# EasyEDA Pro project project-rp2350-board-04-12.epro

# Schematic Schematic1
Board Name: Board1; Create Date: 2025-04-10; Page Name: P1; Project Name: rp2350-impa; Schematic Name: Schematic1; Update Date: 2025-04-12; Company: EasyEDA.com; Page Size: A4; Version: V1.0
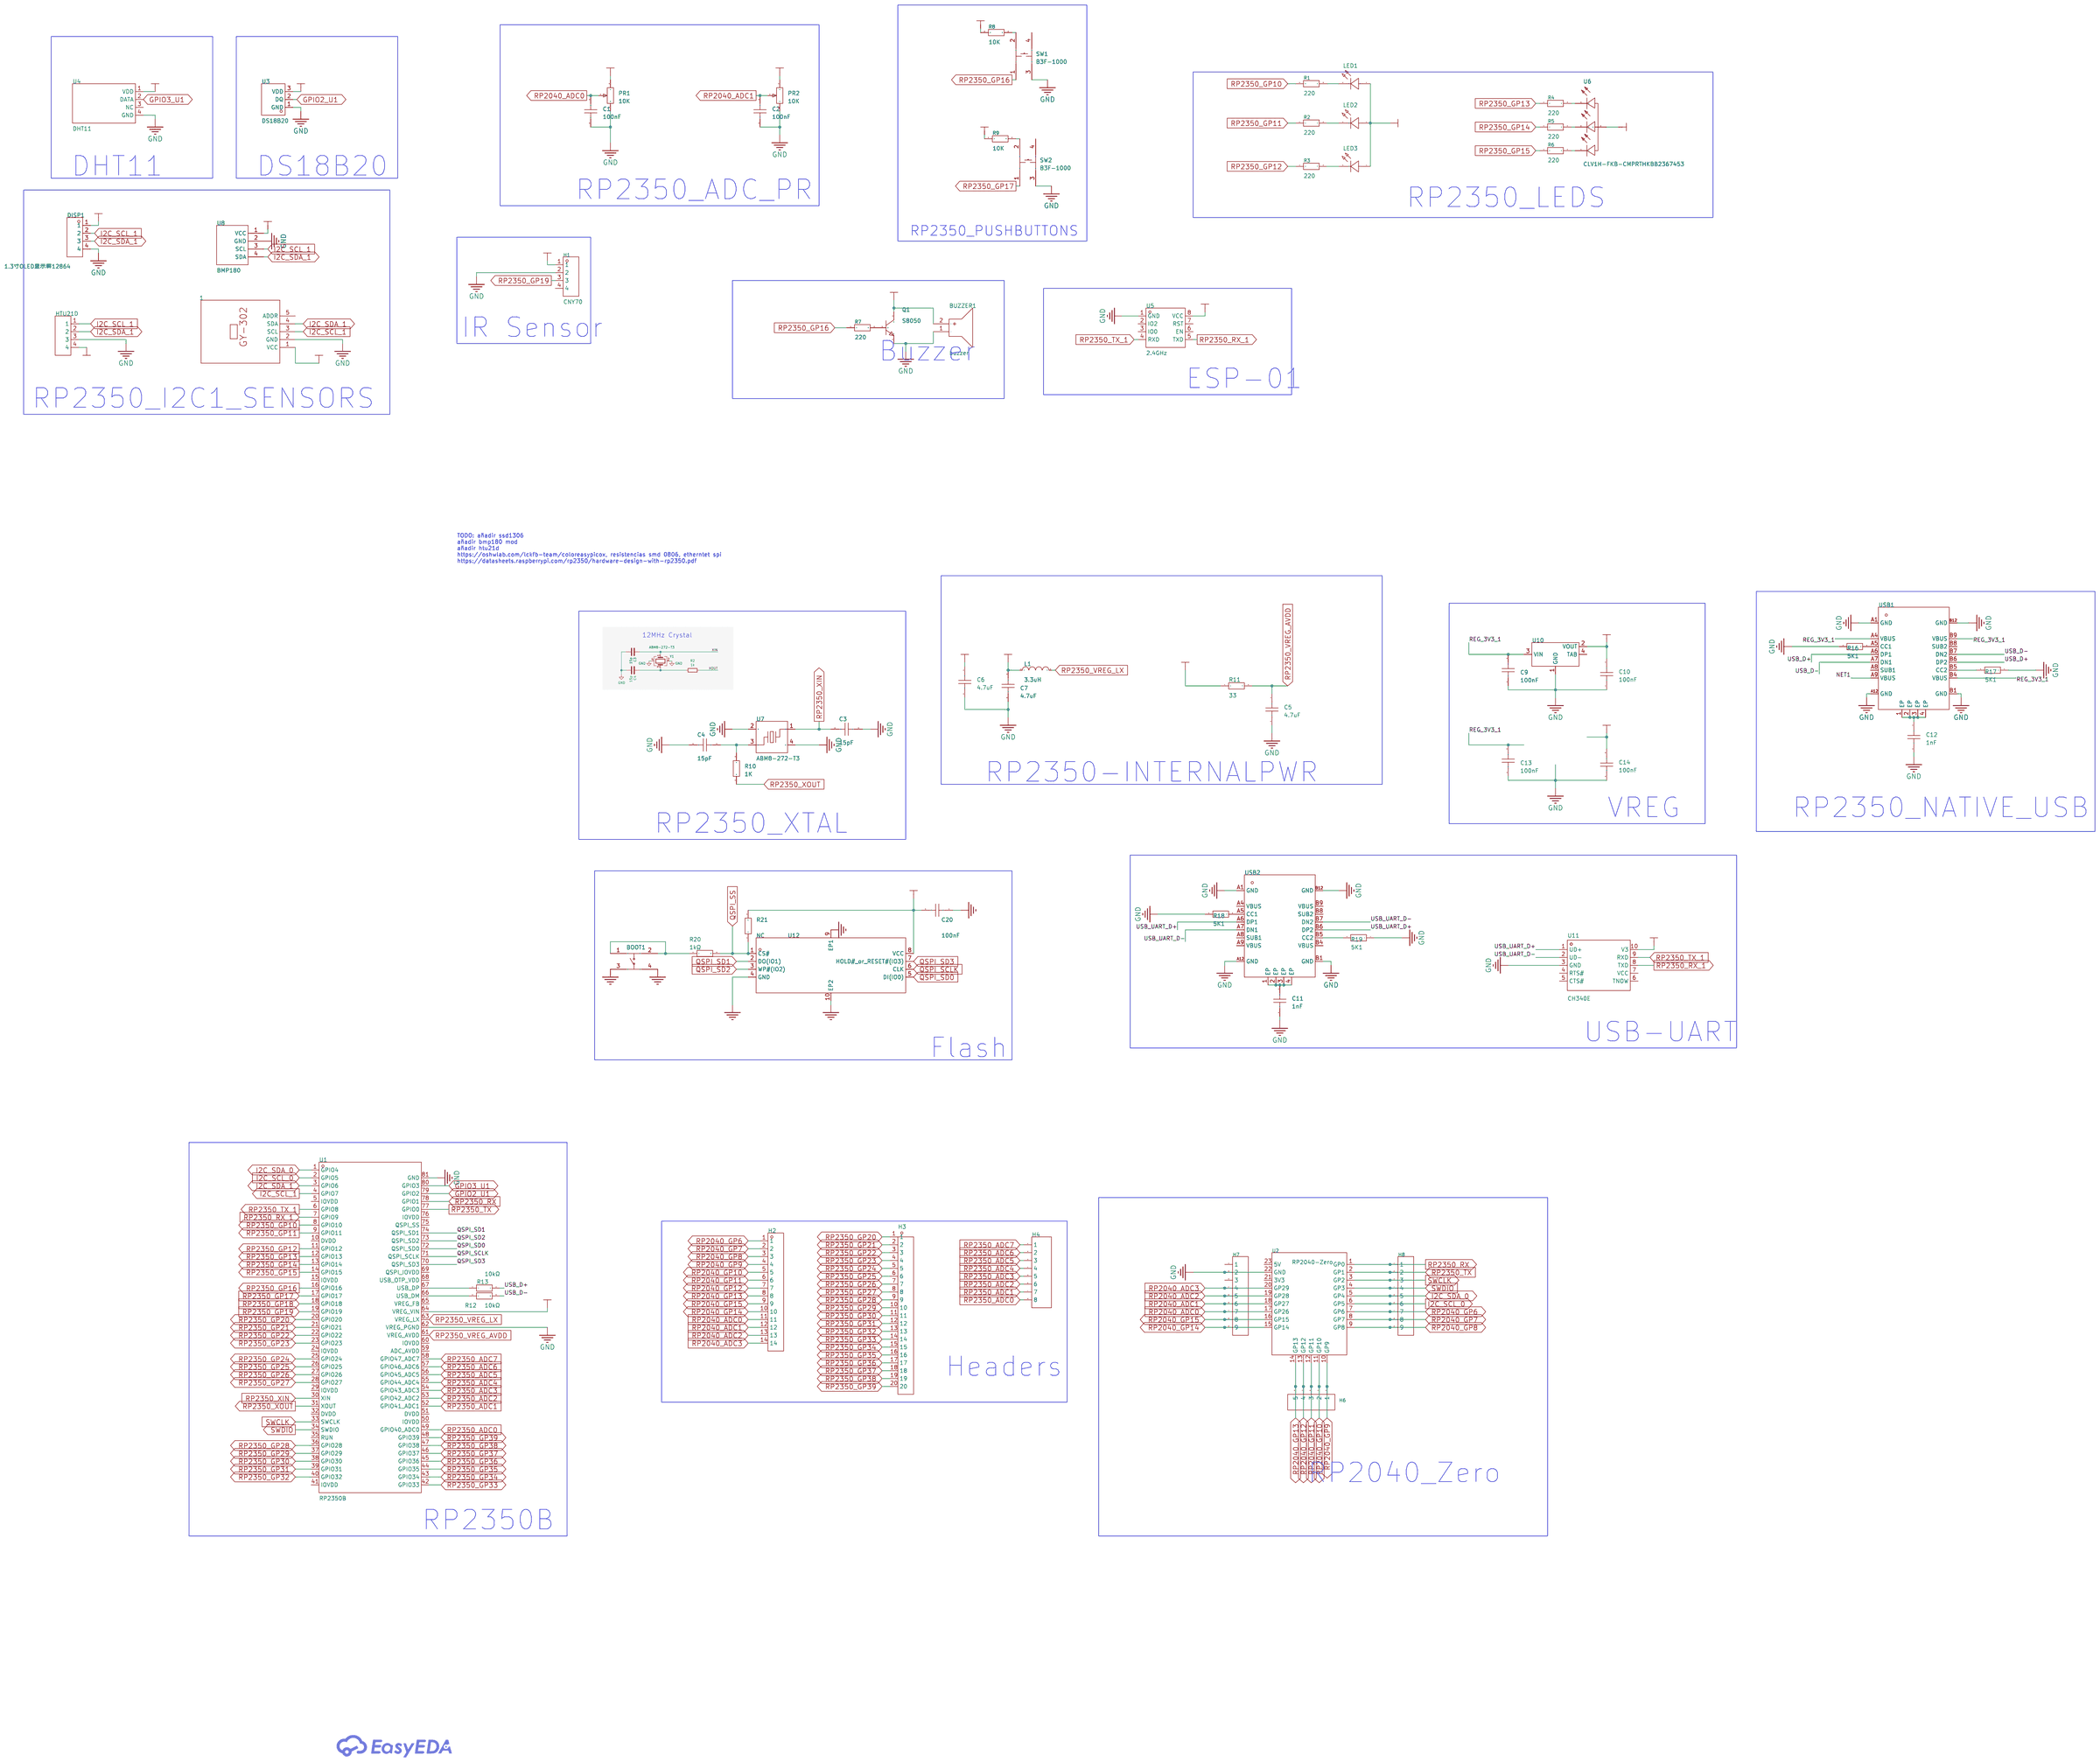
[diagram p0: schematic sheet]

## Parts
1  -  [GY-302 (BH1750)]
BOOT1  K2-1808SN-A4SW-01  [KEY-SMD_4P-L4.2-W3.2-P2.20-LS5.1-TL]
BUZZER1  buzzer  [BUZ-TH_BD12.0-P6.00-D0.9-RD]
C1  100nF  [C0201]
C2  100nF  [C0201]
C3  15pF  [C0201]
C4  15pF  [C0201]
C5  4.7uF  [C0201]
C6  4.7uF  [C0201]
C7  4.7uF  [C0201]
C9  100nF  [C0201]
C10  100nF  [C0201]
C11  1nF  [C0201]
C12  1nF  [C0201]
C13  100nF  [C0201]
C14  100nF  [C0201]
C20  100nF  [R0402]
DISP1  1.3寸OLED显示屏12864  [OLED-TH12864]
H1  CNY70  [HDR-TH_4P-P2.54-V-F]
H2  -  [HDR-TH_14P-P2.54-V-M]
H3  -  [HDR-TH_20P-P2.54-V-M-1]
H4  -  [HDR-TH_8P-P2.54-V-M]
H6  -  [HDR-TH_5P-P2.54-V-F]
H7  -  [HDR-TH_9P-P2.54-V-F-1]
H8  -  [HDR-TH_9P-P2.54-V-F-1]
HTU21D  -  [HDR-TH_4P-P2.54-V-M]
L1  3.3uH  [L0402]
LED1  YLED0805W  [LED0805-R-RD_WHITE]
LED2  YLED0805W  [LED0805-R-RD_WHITE]
LED3  YLED0805W  [LED0805-R-RD_WHITE]
PR1  10K  [RES-ADJ-TH_3P-L9.5-W9.5-P2.54-BR-BS]
PR2  10K  [RES-ADJ-TH_3P-L9.5-W9.5-P2.54-BR-BS]
Q1  S8050  [SOT-23-3_L2.9-W1.3-P1.90-LS2.4-BR]
R1  33kΩ  [R0805]
R2  33kΩ  [R0805]
R3  33kΩ  [R0805]
R4  33kΩ  [R0805]
R5  33kΩ  [R0805]
R6  33kΩ  [R0805]
R7  33kΩ  [R0805]
R8  33kΩ  [R0805]
R9  33kΩ  [R0805]
R10  1K  [R0603]
R11  33  [R0603]
R12  10kΩ  [R0603]
R13  10kΩ  [R0603]
R16  5K1  [R0603]
R17  5K1  [R0603]
R18  5K1  [R0603]
R19  5K1  [R0603]
R20  1kΩ  [R0402]
R21  NC  [R0402]  (no BOM)
SW1  B3F-1000  [KEY-TH_4P-L6.2-W6.2-P4.50-LS6.5]
SW2  B3F-1000  [KEY-TH_4P-L6.2-W6.2-P4.50-LS6.5]
U1  RP2350B  [QFN-80_L10.0-W10.0-P0.40-TL-EP3.4]
U2  RP2040-Zero  [COMM-SMD_RP2040-ZERO]
U3  DS18B20  [TO-92-3_L4.5-W3.5-P1.27-L]
U4  DHT11  [SENSOR-TH_DHT11]
U5  2.4GHz  [WIFIM-TH_8P-L24.7-W14.4-P2.54]
U6  CLV1H-FKB-CMPRTHKBB2367453  [LED-SMD_4P-L3.2-W2.8-LS3.5-TL-B]
U7  ABM8-272-T3  [CRYSTAL-SMD_4P-L3.2-W2.5-BL]
U8  BMP180  [BMP-180]
U10  -  [SOT-223-4_L6.5-W3.5-P2.30-LS7.0-BR]
U11  CH340E  [MSOP-10_L3.0-W3.0-P0.50-LS5.0-BL]
U12  W25Q32JVUUIQ  [USON-8_L4.0-W3.0-P0.80-BL_WINBOND_UU]
USB1  -  [USB-C-SMD_KH-TYPE-C-16P]
USB2  -  [USB-C-SMD_KH-TYPE-C-16P]

## Library data of the parts
1 = GY-302 Light Sensor Module (BH1750)
BOOT1 = K2-1808SN-A4SW-01: 触点电流:50mA;额定电压(DC):12V;绝缘电阻:100MΩ;电路结构:单刀单掷;安装方式:立贴;按钮形状:椭圆形按钮;带灯:-;作用力:250gf@±30gf;机械寿命:100000;工作温度:-25℃~+85℃;开关长度:4.2mm;开关宽度:3.25mm;开关高度:2.5mm;; Circuit: 单刀单掷; Supplier: LCSC; Datasheet: https://atta.szlcsc.com/upload/public/pdf/source/20180927/C283535_7E7907F3E7B6C1691E1DC87E363D082A.pdf; Manufacturer: 韩国韩荣; Switch Width: 3.25mm; Supplier Part: C92589; Switch Height: 2.5mm; Switch Length: 4.2mm; Actuator Style: 椭圆形按钮; LCSC Part Name: 4.2mm*3.25mm; Mounting Sytle: 立贴; Contact Current: 50mA; Mechanical Life: 100000; Operating Force: 250gf@±30gf; JLCPCB Part Class: Extended Part; Supplier Footprint: SMD; Voltage Rating (DC): 12V; Insulation Resistance: 100MΩ; Operating Temperature: -25℃~+85℃
BUZZER1 = buzzer: Supplier Part: C9900014030; JLCPCB Part Class: Extended Part; Supplier: LCSC
C1-C7 C9-C14 = CAP_0201: Supplier Footprint: 0201
C20 = UMK105B7104KVHF: 容值:100nF;精度:±10%;额定电压:50V;材质(温度系数):X7R;; Supplier: LCSC; Datasheet: https://atta.szlcsc.com/upload/public/pdf/source/20190415/C386112_8E88B4AA4AA3A856ADC8B10D69A4BB16.pdf; Tolerance: ±10%; Manufacturer: TAIYO YUDEN(太诱); Supplier Part: C386112; Voltage Rated: 50V; LCSC Part Name: 100nF ±10% 50V UMK105B7104KVHF; JLCPCB Part Class: Extended Part; Supplier Footprint: 0402; Temperature Coefficient: X7R
DISP1 = 1.3寸OLED显示屏12864: Supplier Part: C9900014198; Supplier Footprint: DIP4; JLCPCB Part Class: Extended Part; Supplier: LCSC
H1 = 2.54-1*4P母: Holes Structure:1x4P Pitch:2.54mm Row Spacing:- Circular Hole / Square Hole:Square Holes Mounting Type:Straight Number of Rows:Plugin Number of Holes:4P Current Rating (Max):3A Voltage Rating (Max):- Holes Direction:Top Insulation Height:- Contact Materia; LCSC Part Name: 间距:2.54mm 1x4P 直插; Supplier Part: C2718488; Manufacturer: BOOMELE(博穆精密); Supplier Footprint: 插件,P=2.54mm; JLCPCB Part Class: Extended Part; Datasheet: https://atta.szlcsc.com/upload/public/pdf/source/20210301/C2718488_F4427B881E42CAA8DDB0B1C12B3A522C.pdf; Supplier: LCSC; Holes Structure: 1x4P; Pitch: 2.54mm; Circular Hole / Square Hole: Square Holes; Mounting Type: Straight; Number of Rows: Plugin; Number of Holes: 4P; Current Rating (Max): 3A; Holes Direction: Top; Contact Material: bronze; Operating Temperature Range: -40℃~+105℃
H2 = HDR-M_2.54_1x14P: Supplier Footprint: Through
H3 = HDR-M_2.54_1x20P: Supplier Footprint: Through
H4 = HDR-M_2.54_1x8P: Supplier Footprint: Through
H6 = HDR-F_2.54_1x5P: Supplier Footprint: Through
H7 H8 = HDR-F_2.54_1x9P: Supplier Footprint: Through
HTU21D = HDR-M_2.54_1x4P: Supplier Footprint: Through
L1 = L_0402
LED1-LED3 = YLED0805W: LCSC Part Name: 发光管; Supplier Part: C25170729; Manufacturer: YONGYUTAI(永裕泰); Supplier Footprint: 0805; JLCPCB Part Class: Extended Part; Datasheet: https://atta.szlcsc.com/upload/public/pdf/source/20240703/126B208D660AB42951DB015B878B749A.pdf; Supplier: LCSC
PR1 PR2 = R_3386P: Supplier Footprint: Through
Q1 = S8050_C2992076: Supplier Part: C2992076; Manufacturer: 星海; Supplier Footprint: SOT-23; JLCPCB Part Class: Extended Part; Datasheet: https://atta.szlcsc.com/upload/public/pdf/source/20220412/23B2261F7486AF0B250D66C32D3117E2.pdf; Supplier: LCSC
R1-R9 = 0805W8F3302T5E: Type:Thick Film Resistors Resistance:33kΩ Tolerance:±1% Tolerance:±1% Power(Watts): Overload Voltage (Max): Temperature Coefficient:±100ppm/℃ Temperature Coefficient:±100ppm/℃ Operating Temperature Range:-55℃~+155℃ Operating Temperature Range:-55℃~+155℃; LCSC Part Name: 33kΩ ±1% 125mW 厚膜电阻; Supplier Part: C17633; Manufacturer: UNI-ROYAL(厚声); Supplier Footprint: 0805; JLCPCB Part Class: Basic Part; Datasheet: https://atta.szlcsc.com/upload/public/pdf/source/20200306/C422600_1E6D84923E4A46A82E41ADD87F860B5C.pdf; Supplier: LCSC; Type: Thick Film Resistors; Tolerance: ±1%; Temperature Coefficient: ±100ppm/℃; Operating Temperature Range: -55℃~+155℃
R10 R11 R16-R19 R21 = Res_0603: Supplier Footprint: 0603
R12 R13 = FRC0603J103 TS: Type:Thick Film Resistors Resistance:10kΩ Tolerance:±5% Tolerance:±5% Power(Watts):0.1W Voltage-Supply(Max):75V Temperature Coefficient:±100ppm/℃ Temperature Coefficient:±100ppm/℃ Operating Temperature:-55℃~+155℃ Operating Temperature:-55℃~+155℃; LCSC Part Name: 10kΩ ±5% 100mW 厚膜电阻; Supplier Part: C2930027; Manufacturer: FOJAN(富捷); Supplier Footprint: 0603; JLCPCB Part Class: Extended Part; Datasheet: https://atta.szlcsc.com/upload/public/pdf/source/20211221/925EC7D7225764EE0046F22065062C87.pdf; Supplier: LCSC; Type: Thick Film Resistors; Tolerance: ±5%; Power(Watts): 0.1W; Voltage-Supply(Max): 75V; Temperature Coefficient: ±100ppm/℃; Operating Temperature: -55℃~+155℃
R20 = 0402WGJ0102TCE: 电阻类型:厚膜电阻;阻值:1kΩ;精度:±5%;功率:62.5mW;; Type: 厚膜电阻; Supplier: LCSC; Datasheet: https://atta.szlcsc.com/upload/public/pdf/source/20200306/C422600_1E6D84923E4A46A82E41ADD87F860B5C.pdf; Tolerance: ±5%; Manufacturer: UNI-ROYAL(厚声); Power(Watts): 62.5mW; Supplier Part: C25543; LCSC Part Name: 1kΩ ±5% 62.5mW; JLCPCB Part Class: Extended Part; Supplier Footprint: 0402; Overload Voltage (Max): 50V; Temperature Coefficient: ±100ppm/℃; Operating Temperature Range: -55℃~+155℃
SW1 SW2 = B3F-1000: Circuit:SPST Actuator Style:Round Button Mounting Style:- Switch Length:6mm Switch Width:6mm Switch Height:4.3mm Contact Current:50mA Voltage Rating (DC):24V With Lamp:- Mechanical Life:-; Supplier Part: C93157; Manufacturer: OMRON(欧姆龙); Supplier Footprint: 插件-4P,6x6mm; JLCPCB Part Class: Extended Part; Supplier: LCSC; Circuit: SPST; Actuator Style: Round Button; Switch Length: 6mm; Switch Width: 6mm; Switch Height: 4.3mm; Contact Current: 50mA; Voltage Rating (DC): 24V
U1 = RP2350B_C42415655: Supplier Part: C42415655; Manufacturer: Raspberry Pi(树莓派); Supplier Footprint: QFN-80-EP(10x10); JLCPCB Part Class: Extended Part; Datasheet: https://atta.szlcsc.com/upload/public/pdf/source/20241210/0989AB86AAD7A21936E5CD12ADC9EA29.pdf; Supplier: LCSC
U2 = RP2040-Zero: LCSC Part Name: 微雪 树莓派RP2040-Zero微控制器 PICO开发板 RP2040双核处理器; Supplier Part: C5350143; Manufacturer: Waveshare(微雪电子); Supplier Footprint: LCC-22(18x23.5); JLCPCB Part Class: Extended Part; Datasheet: https://atta.szlcsc.com/upload/public/pdf/source/20230328/F7ADB41143C3623278858A7E8047DBCD.pdf; Supplier: LCSC
U3 = DS18B20_C5451632: Temperature Range:-10℃~70℃ Temperature Range:-10℃~70℃ Tolerance:±0.4℃ Tolerance:±0.4℃ Voltage - Supply:2.5V~5.5V Voltage - Supply:2.5V~5.5V Standby Current:- Interface:-; LCSC Part Name: 温度-10℃~70℃ 精度±0.4℃ 电压2.5V~5.5V; Supplier Part: C5451632; Manufacturer: HXY MOSFET(华轩阳电子); Supplier Footprint: TO-92; JLCPCB Part Class: Extended Part; Datasheet: https://atta.szlcsc.com/upload/public/pdf/source/20230427/F43BF9FBC8AD29BCFCC811AFA154CBDD.pdf; Supplier: LCSC; Temperature Range: -10℃~70℃; Tolerance: ±0.4℃; Voltage - Supply: 2.5V~5.5V
U4 = DHT11_C117051: LCSC Part Name: 新款电容式数字温湿度传感器,老款已停产16.1x12.6x5.8mm DHT11  电容式传感器; Supplier Part: C117051; Manufacturer: 广州奥松; Supplier Footprint: SIP-4; JLCPCB Part Class: Extended Part; Datasheet: https://atta.szlcsc.com/upload/public/pdf/source/20170703/1499081238365.pdf; Supplier: LCSC
U5 = ESP-01S_C503582: Core Processor:ESP8266芯片 Wireless Standard:- Support Interface:GPIO；UART；PWM Frequency:2.4GHz Antenna Type:板载PCBAntenna Output Power:16dBm Output Power:16dBm Operating Voltage:3V~3.6V Operating Voltage:3V~3.6V Receive  Current:56mA Send  Current:170mA Sen; LCSC Part Name: 完整的802.11b/g/nWi-FiSoC模块; Supplier Part: C503582; Manufacturer: Ai-Thinker(安信可); Manufacturer Part: ESP-01S; JLCPCB Part Class: Extended Part; Datasheet: https://atta.szlcsc.com/upload/public/pdf/source/20200407/C503582_1139AF8FB42E05635FA0089E1752A536.pdf; Supplier: LCSC; Core Processor: ESP8266芯片; Support Interface: GPIO；UART；PWM; Antenna Type: 板载PCBAntenna; Output Power: 16dBm; Operating Voltage: 3V~3.6V; Receive  Current: 56mA; Send  Current: 170mA; Sensitivity: -90dBm; Operating Temperature: -20℃~+70℃
U6 = CLV1H-FKB-CMPRTHKBB2367453: Diode Configuration:Common Anode; Supplier Part: C6883191; Manufacturer: Wolfspeed; Supplier Footprint: PLCC-4; JLCPCB Part Class: Extended Part; Supplier: LCSC; Diode Configuration: Common Anode
U7 = ABM8-272-T3_C20625731: Supplier Part: C20625731; Manufacturer: ABRACON; Supplier Footprint: SMD3225-4P; JLCPCB Part Class: Extended Part; Datasheet: https://atta.szlcsc.com/upload/public/pdf/source/20240227/A8BE43F636D80F75C9AF5C59EDF21E9A.pdf; Supplier: LCSC
U8 = BMP180: 3DModel: BMP180V1 COPY COPY COPY
U10 = AMS1117-3.3V: Supplier Footprint: SOT-223
U11 = CH340E: Applications Function:Transceiver Protocol: Supply Voltage:3.3V；5V Supply Voltage:3.3V；5V Data Rate:2Mbps; LCSC Part Name: USB转串口芯片CH340; Supplier Part: C99652; Manufacturer: WCH(南京沁恒); Supplier Footprint: MSOP-10; JLCPCB Part Class: Extended Part; Datasheet: https://atta.szlcsc.com/upload/public/pdf/source/20240313/4FD4567B6A986AE079C4960D6CEBDDB5.pdf; Supplier: LCSC; Applications Function: Transceiver; Supply Voltage: 3.3V；5V; Data Rate: 2Mbps
U12 = W25Q32JVUUIQ: 3V 32M-BIT SERIAL FLASH MEMORY WITH DUAL, QUAD SPI; Supplier Part: C2999380; Manufacturer: WINBOND(华邦); Supplier Footprint: USON-8(3x4); JLCPCB Part Class: 扩展库; Datasheet: https://atta.szlcsc.com/upload/public/pdf/source/20220419/71F2D20BDA1217995CECC027DED216BE.pdf; Supplier: LCSC
USB1 USB2 = USB_TYPE-C-16P: Supplier Footprint: Through

## Nets
1V1: C7.2 L1.1
3V3: 1.1(VCC) BUZZER1.2(+) C6.1 C10.2 C14.2 C20.2 DISP1.1 H1.1 HTU21D.4 LED1.1(A) LED2.1(A) LED3.1(A) PR1.1 PR2.1 Q1.3(C) R8.1 R9.1 R11.1 R21.2 U1.64(VREG_VIN) U3.3(VDD) U4.1(VDD) U5.8(VCC) U6.1 U8.1(VCC) U10.2(VOUT) U11.10(V3) U12.8(VCC)
GND: 1.2(GND) BOOT1.3 BOOT1.4 BUZZER1.1(-) C1.2 C2.2 C3.1 C4.2 C5.2 C6.2 C7.1 C9.1 C10.1 C11.2 C12.2 C13.1 C14.1 C20.1 DISP1.4 H1.2 H7.2 HTU21D.3 PR1.3 PR2.3 Q1.2(E) R16.1 R17.1 R18.1 R19.1 SW1.3 SW2.3 U1.62(VREG_PGND) U1.81(GND) U2.22(GND) U3.1(GND) U4.4(GND) U5.1(GND) U7.2(GND) U7.4(GND) U8.2(GND) U10.1(GND) U11.3(GND) U12.4(GND) U12.9(EP1) U12.10(EP2) USB1.A1(GND) USB1.A12(GND) USB1.B1(GND) USB1.B12(GND) USB2.A1(GND) USB2.A12(GND) USB2.B1(GND) USB2.B12(GND)
GPIO2_U1: U1.79(GPIO2) U3.2(DQ)
GPIO3_U1: U1.80(GPIO3) U4.2(DATA)
I2C_SCL_0: H8.6 U1.2(GPIO5) U2.6(GP5)
I2C_SCL_1: 1.3(SCL) DISP1.2 HTU21D.1 U1.4(GPIO7) U8.3(SCL)
I2C_SDA_0: H8.5 U1.1(GPIO4) U2.5(GP4)
I2C_SDA_1: 1.4(SDA) DISP1.3 HTU21D.2 U1.3(GPIO6) U8.4(SDA)
NET1: USB1.A9(VBUS)
QSPI_SCLK: U1.71(QSPI_SCLK) U12.6(CLK)
QSPI_SD0: U1.72(QSPI_SD0) U12.5(DI(IO0))
QSPI_SD1: U1.74(QSPI_SD1) U12.2(DO(IO1))
QSPI_SD2: U1.73(QSPI_SD2) U12.3(WP#(IO2))
QSPI_SD3: U1.70(QSPI_SD3) U12.7(HOLD# or RESET#(IO3))
QSPI_SS: R20.2 R21.1 U12.1(CS#)
REG_3V3_1: C9.2 C13.2 U10.3(VIN) USB1.A4(VBUS) USB1.B4(VBUS) USB1.B9(VBUS)
RP2040_ADC0: C1.1 H2.11 H7.7 PR1.2 U2.17(GP26)
RP2040_ADC1: C2.1 H2.12 H7.6 PR2.2 U2.18(GP27)
RP2040_ADC2: H2.13 H7.5 U2.19(GP28)
RP2040_ADC3: H2.14 H7.4 U2.20(GP29)
RP2040_GP6: H2.1 H8.7 U2.7(GP6)
RP2040_GP7: H2.2 H8.8 U2.8(GP7)
RP2040_GP8: H2.3 H8.9 U2.9(GP8)
RP2040_GP9: H2.4 H6.1 U2.10(GP9)
RP2040_GP10: H2.5 H6.2 U2.11(GP10)
RP2040_GP11: H2.6 H6.3 U2.12(GP11)
RP2040_GP12: H2.7 H6.4 U2.13(GP12)
RP2040_GP13: H2.8 H6.5 U2.14(GP13)
RP2040_GP14: H2.10 H7.9 U2.15(GP14)
RP2040_GP15: H2.9 H7.8 U2.16(GP15)
RP2350_ADC0: H4.8 U1.49(GPIO40_ADC0)
RP2350_ADC1: H4.7 U1.52(GPIO41_ADC1)
RP2350_ADC2: H4.6 U1.53(GPIO42_ADC2)
RP2350_ADC3: H4.5 U1.54(GPIO43_ADC3)
RP2350_ADC4: H4.4 U1.55(GPIO44_ADC4)
RP2350_ADC5: H4.3 U1.56(GPIO45_ADC5)
RP2350_ADC6: H4.2 U1.57(GPIO46_ADC6)
RP2350_ADC7: H4.1 U1.58(GPIO47_ADC7)
RP2350_GP10: R1.1 U1.8(GPIO10)
RP2350_GP11: R2.1 U1.9(GPIO11)
RP2350_GP12: R3.1 U1.11(GPIO12)
RP2350_GP13: R4.1 U1.12(GPIO13)
RP2350_GP14: R5.1 U1.13(GPIO14)
RP2350_GP15: R6.1 U1.14(GPIO15)
RP2350_GP16: R7.1 SW1.1 U1.16(GPIO16)
RP2350_GP17: SW2.1 U1.17(GPIO17)
RP2350_GP18: U1.18(GPIO18)
RP2350_GP19: H1.3 U1.19(GPIO19)
RP2350_GP20: H3.1 U1.20(GPIO20)
RP2350_GP21: H3.2 U1.21(GPIO21)
RP2350_GP22: H3.3 U1.22(GPIO22)
RP2350_GP23: H3.4 U1.23(GPIO23)
RP2350_GP24: H3.5 U1.25(GPIO24)
RP2350_GP25: H3.6 U1.26(GPIO25)
RP2350_GP26: H3.7 U1.27(GPIO26)
RP2350_GP27: H3.8 U1.28(GPIO27)
RP2350_GP28: H3.9 U1.36(GPIO28)
RP2350_GP29: H3.10 U1.37(GPIO29)
RP2350_GP30: H3.11 U1.38(GPIO30)
RP2350_GP31: H3.12 U1.39(GPIO31)
RP2350_GP32: H3.13 U1.40(GPIO32)
RP2350_GP33: H3.14 U1.42(GPIO33)
RP2350_GP34: H3.15 U1.43(GPIO34)
RP2350_GP35: H3.16 U1.44(GPIO35)
RP2350_GP36: H3.17 U1.45(GPIO36)
RP2350_GP37: H3.18 U1.46(GPIO37)
RP2350_GP38: H3.19 U1.47(GPIO38)
RP2350_GP39: H3.20 U1.48(GPIO39)
RP2350_RX: H8.1 U1.78(GPIO1) U2.1(GP0)
RP2350_RX_1: U1.7(GPIO9) U5.5(TXD) U11.8(TXD)
RP2350_TX: H8.2 U1.77(GPIO0) U2.2(GP1)
RP2350_TX_1: U1.6(GPIO8) U5.4(RXD) U11.9(RXD)
RP2350_VREG_AVDD: C5.1 R11.2 U1.61(VREG_AVDD)
RP2350_VREG_LX: L1.2 U1.63(VREG_LX)
RP2350_XIN: C3.2 U1.30(XIN) U7.1
RP2350_XOUT: R10.1 U1.31(XOUT)
SWCLK: H8.3 U1.33(SWCLK) U2.3(GP2)
SWDIO: H8.4 U1.34(SWDIO) U2.4(GP3)
USB_D+: R13.2 USB1.A6(DP1) USB1.B6(DP2)
USB_D-: R12.2 USB1.A7(DN1) USB1.B7(DN2)
USB_UART_D+: U11.1(UD+) USB2.A6(DP1) USB2.B6(DP2)
USB_UART_D-: U11.2(UD-) USB2.A7(DN1) USB2.B7(DN2)
$1N3968: LED1.2(K) R1.2
$1N3972: LED2.2(K) R2.2
$1N3977: LED3.2(K) R3.2
$1N4027: R6.2 U6.4
$1N4032: R5.2 U6.3
$1N4037: R4.2 U6.2
$1N4236: Q1.1(B) R7.2
$1N4467: R8.2 SW1.2
$1N4681: R9.2 SW2.2
$1N8203: C4.1 R10.2 U7.3
$1N10864: R12.1 U1.66(USB_DM)
$1N10892: R13.1 U1.67(USB_DP)
$1N15103: R16.2 USB1.A5(CC1)
$1N15154: R17.2 USB1.B5(CC2)
$1N16224: R19.2 USB2.B5(CC2)
$1N16240: R18.2 USB2.A5(CC1)
$1N16303: C11.1 USB2.1(EP) USB2.2(EP) USB2.3(EP) USB2.4(EP)
$1N16516: C12.1 USB1.1(EP) USB1.2(EP) USB1.3(EP) USB1.4(EP)
Net-(BOOT1-1): BOOT1.1 BOOT1.2 R20.1

Not connected (* = marked no-connect by the designer): 1 5(ADDR); H1 4; H7 1 3; SW1 4; SW2 4; U1 5(IOVDD) 10(DVDD) 15(IOVDD) 24(IOVDD) 29(IOVDD) 32(DVDD) 35(RUN) 41(IOVDD) 50(IOVDD) 51(DVDD) 59(ADC_AVDD) 60(IOVDD) 65(VREG_FB) 68(USB_OTP_VDD) 69(QSPI_IOVDD) 75(QSPI_SS) 76(IOVDD); U2 21(3V3) 23(5V); U4 3(NC); U5 2(IO2) 3(IO0) 6(EN) 7(RST); U10 4(TAB); U11 4(RTS#) 5(CTS#) 6(TNOW) 7(VCC); USB1 A8(SUB1) B8(SUB2); USB2 A4(VBUS) A8(SUB1) A9(VBUS) B4(VBUS) B8(SUB2) B9(VBUS)

## Notes on the sheet
- DHT11
- DS18B20
- RP2350_ADC_PR
- RP2350_LEDS
- RP2350_PUSHBUTTONS
- IR Sensor
- Buzzer
- ESP-01
- RP2350_I2C1_SENSORS
- TODO: añadir ssd1306
  añadir bmp180 mod
  añadir htu21d
  https://oshwlab.com/lckfb-team/coloreasypicox, resistencias smd 0806, etherntet spi
  https://datasheets.raspberrypi.com/rp2350/hardware-design-with-rp2350.pdf
- RP2350-INTERNALPWR
- VREG
- RP2350_NATIVE_USB
- RP2350_XTAL
- USB-UART
- Flash
- Headers
- RP2040_Zero
- RP2350B

# Board PCB1
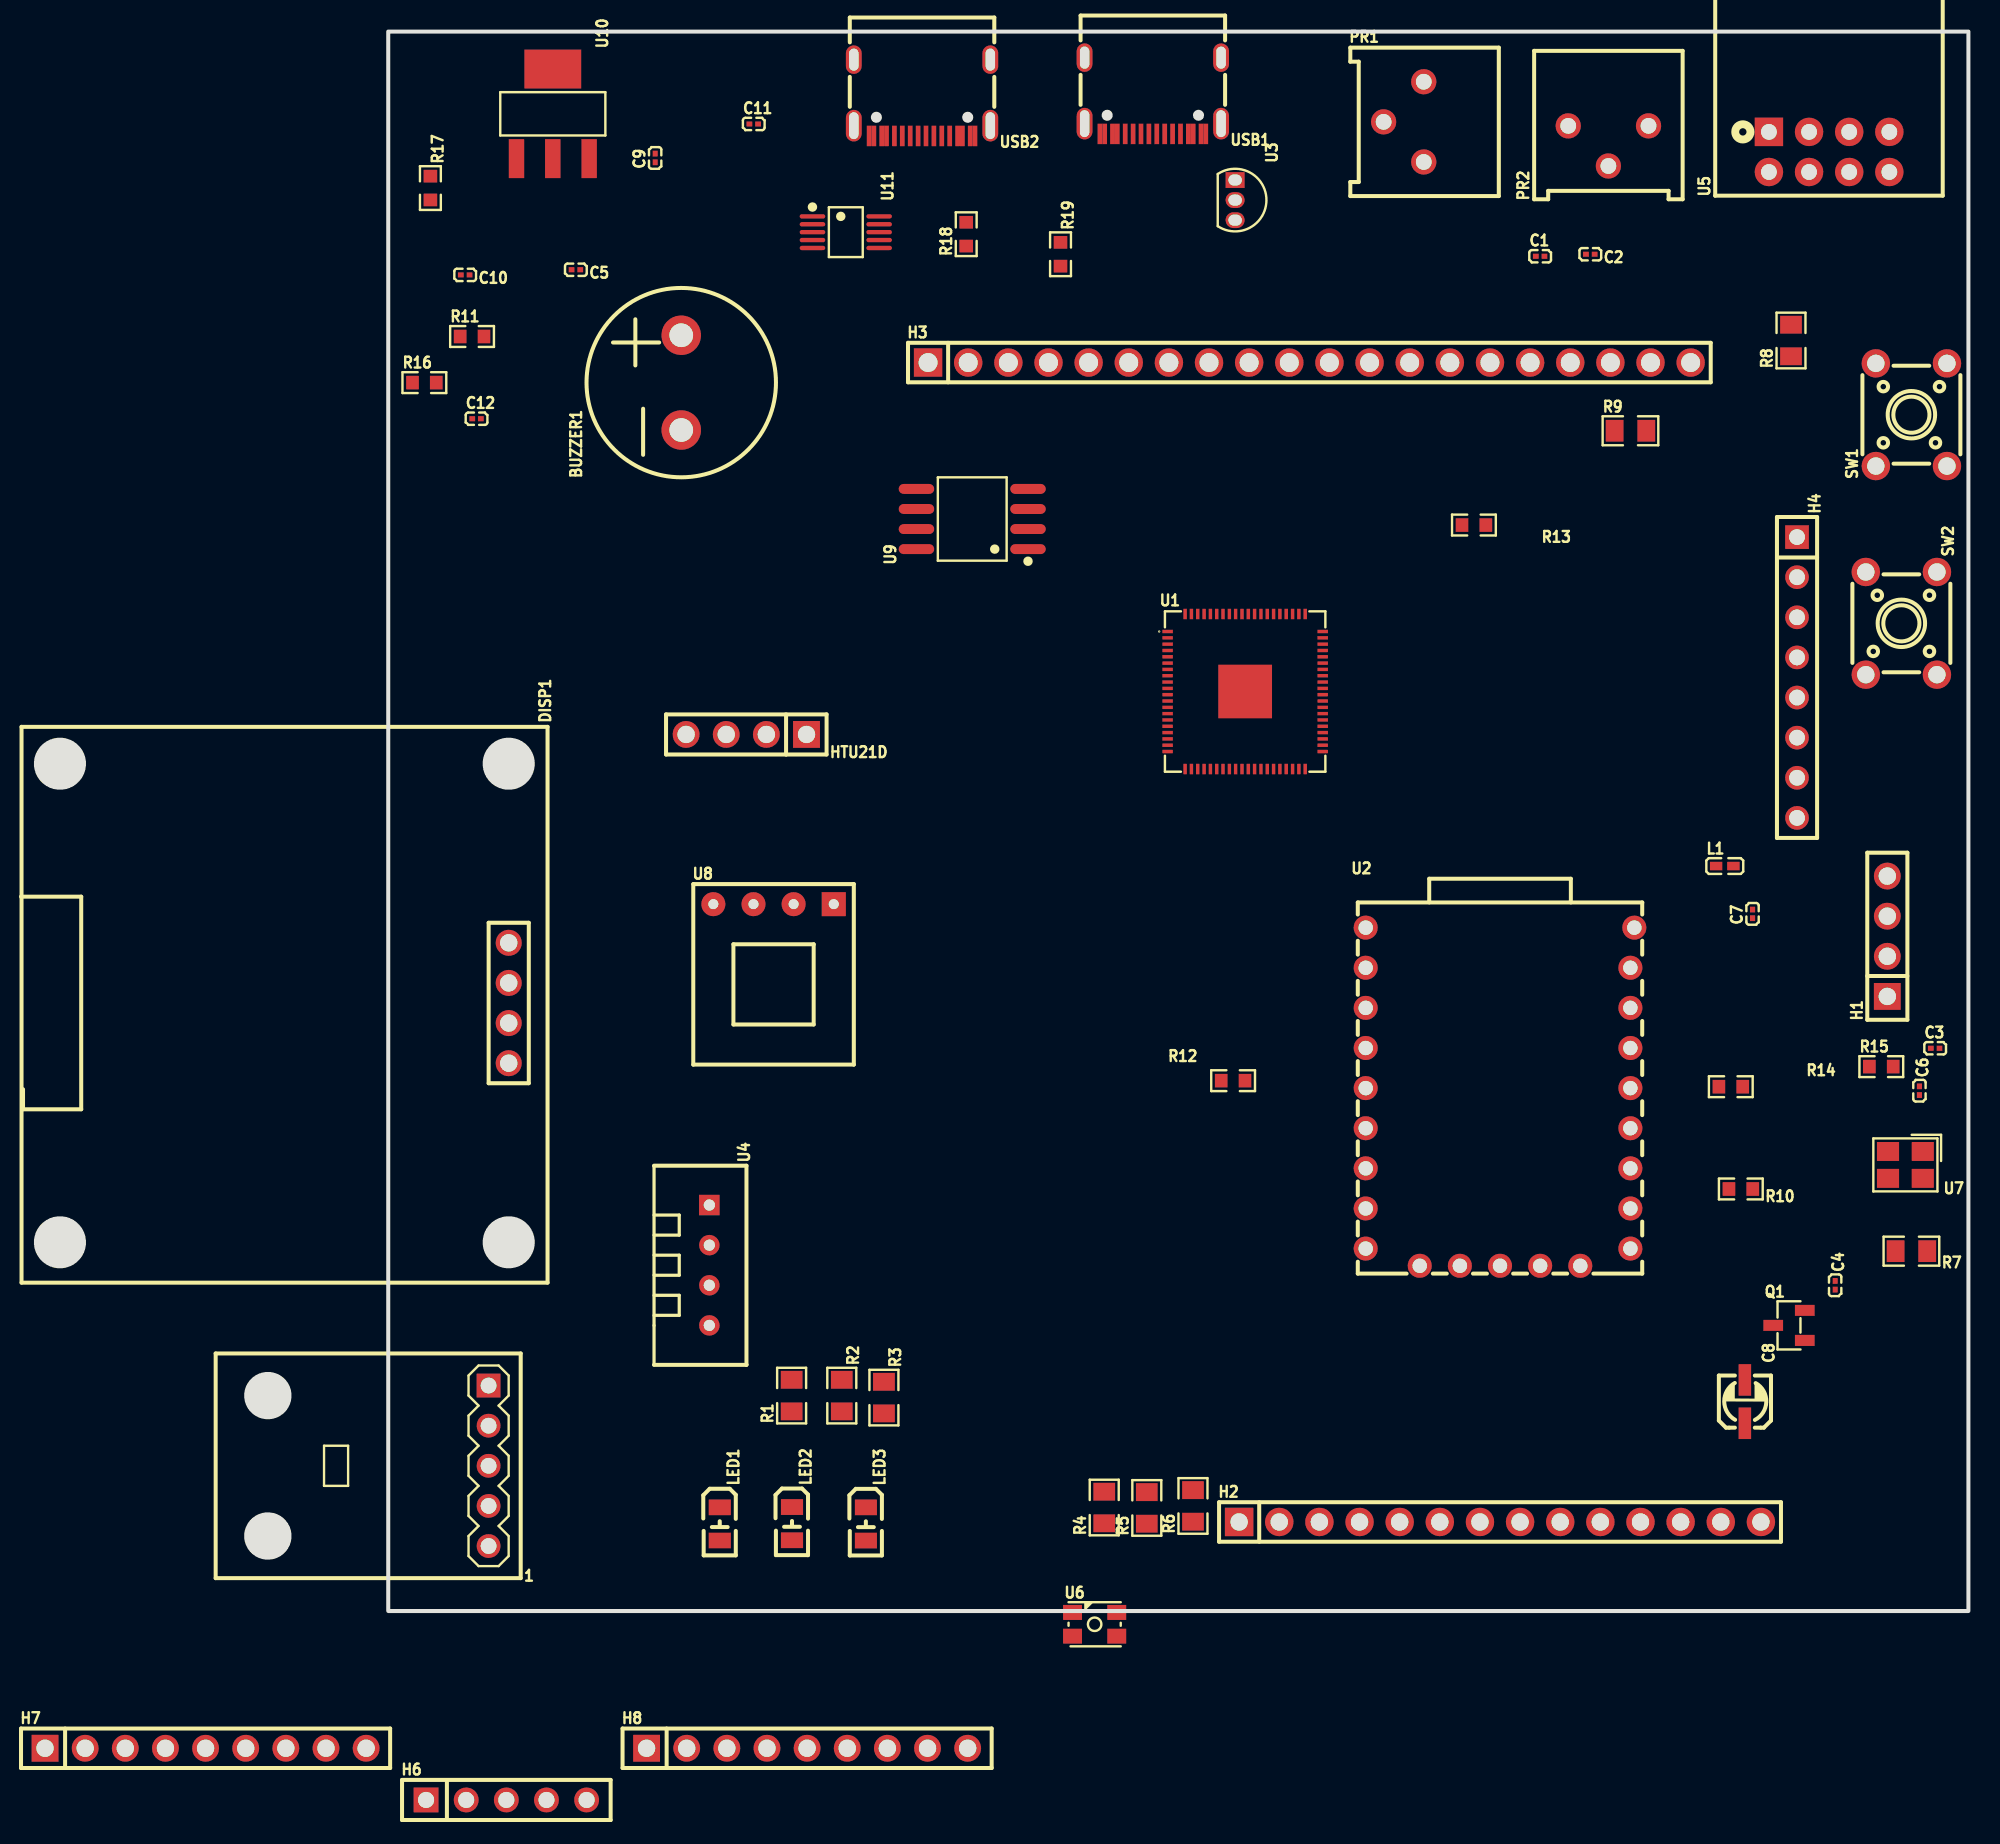
[diagram p1: board, top side]
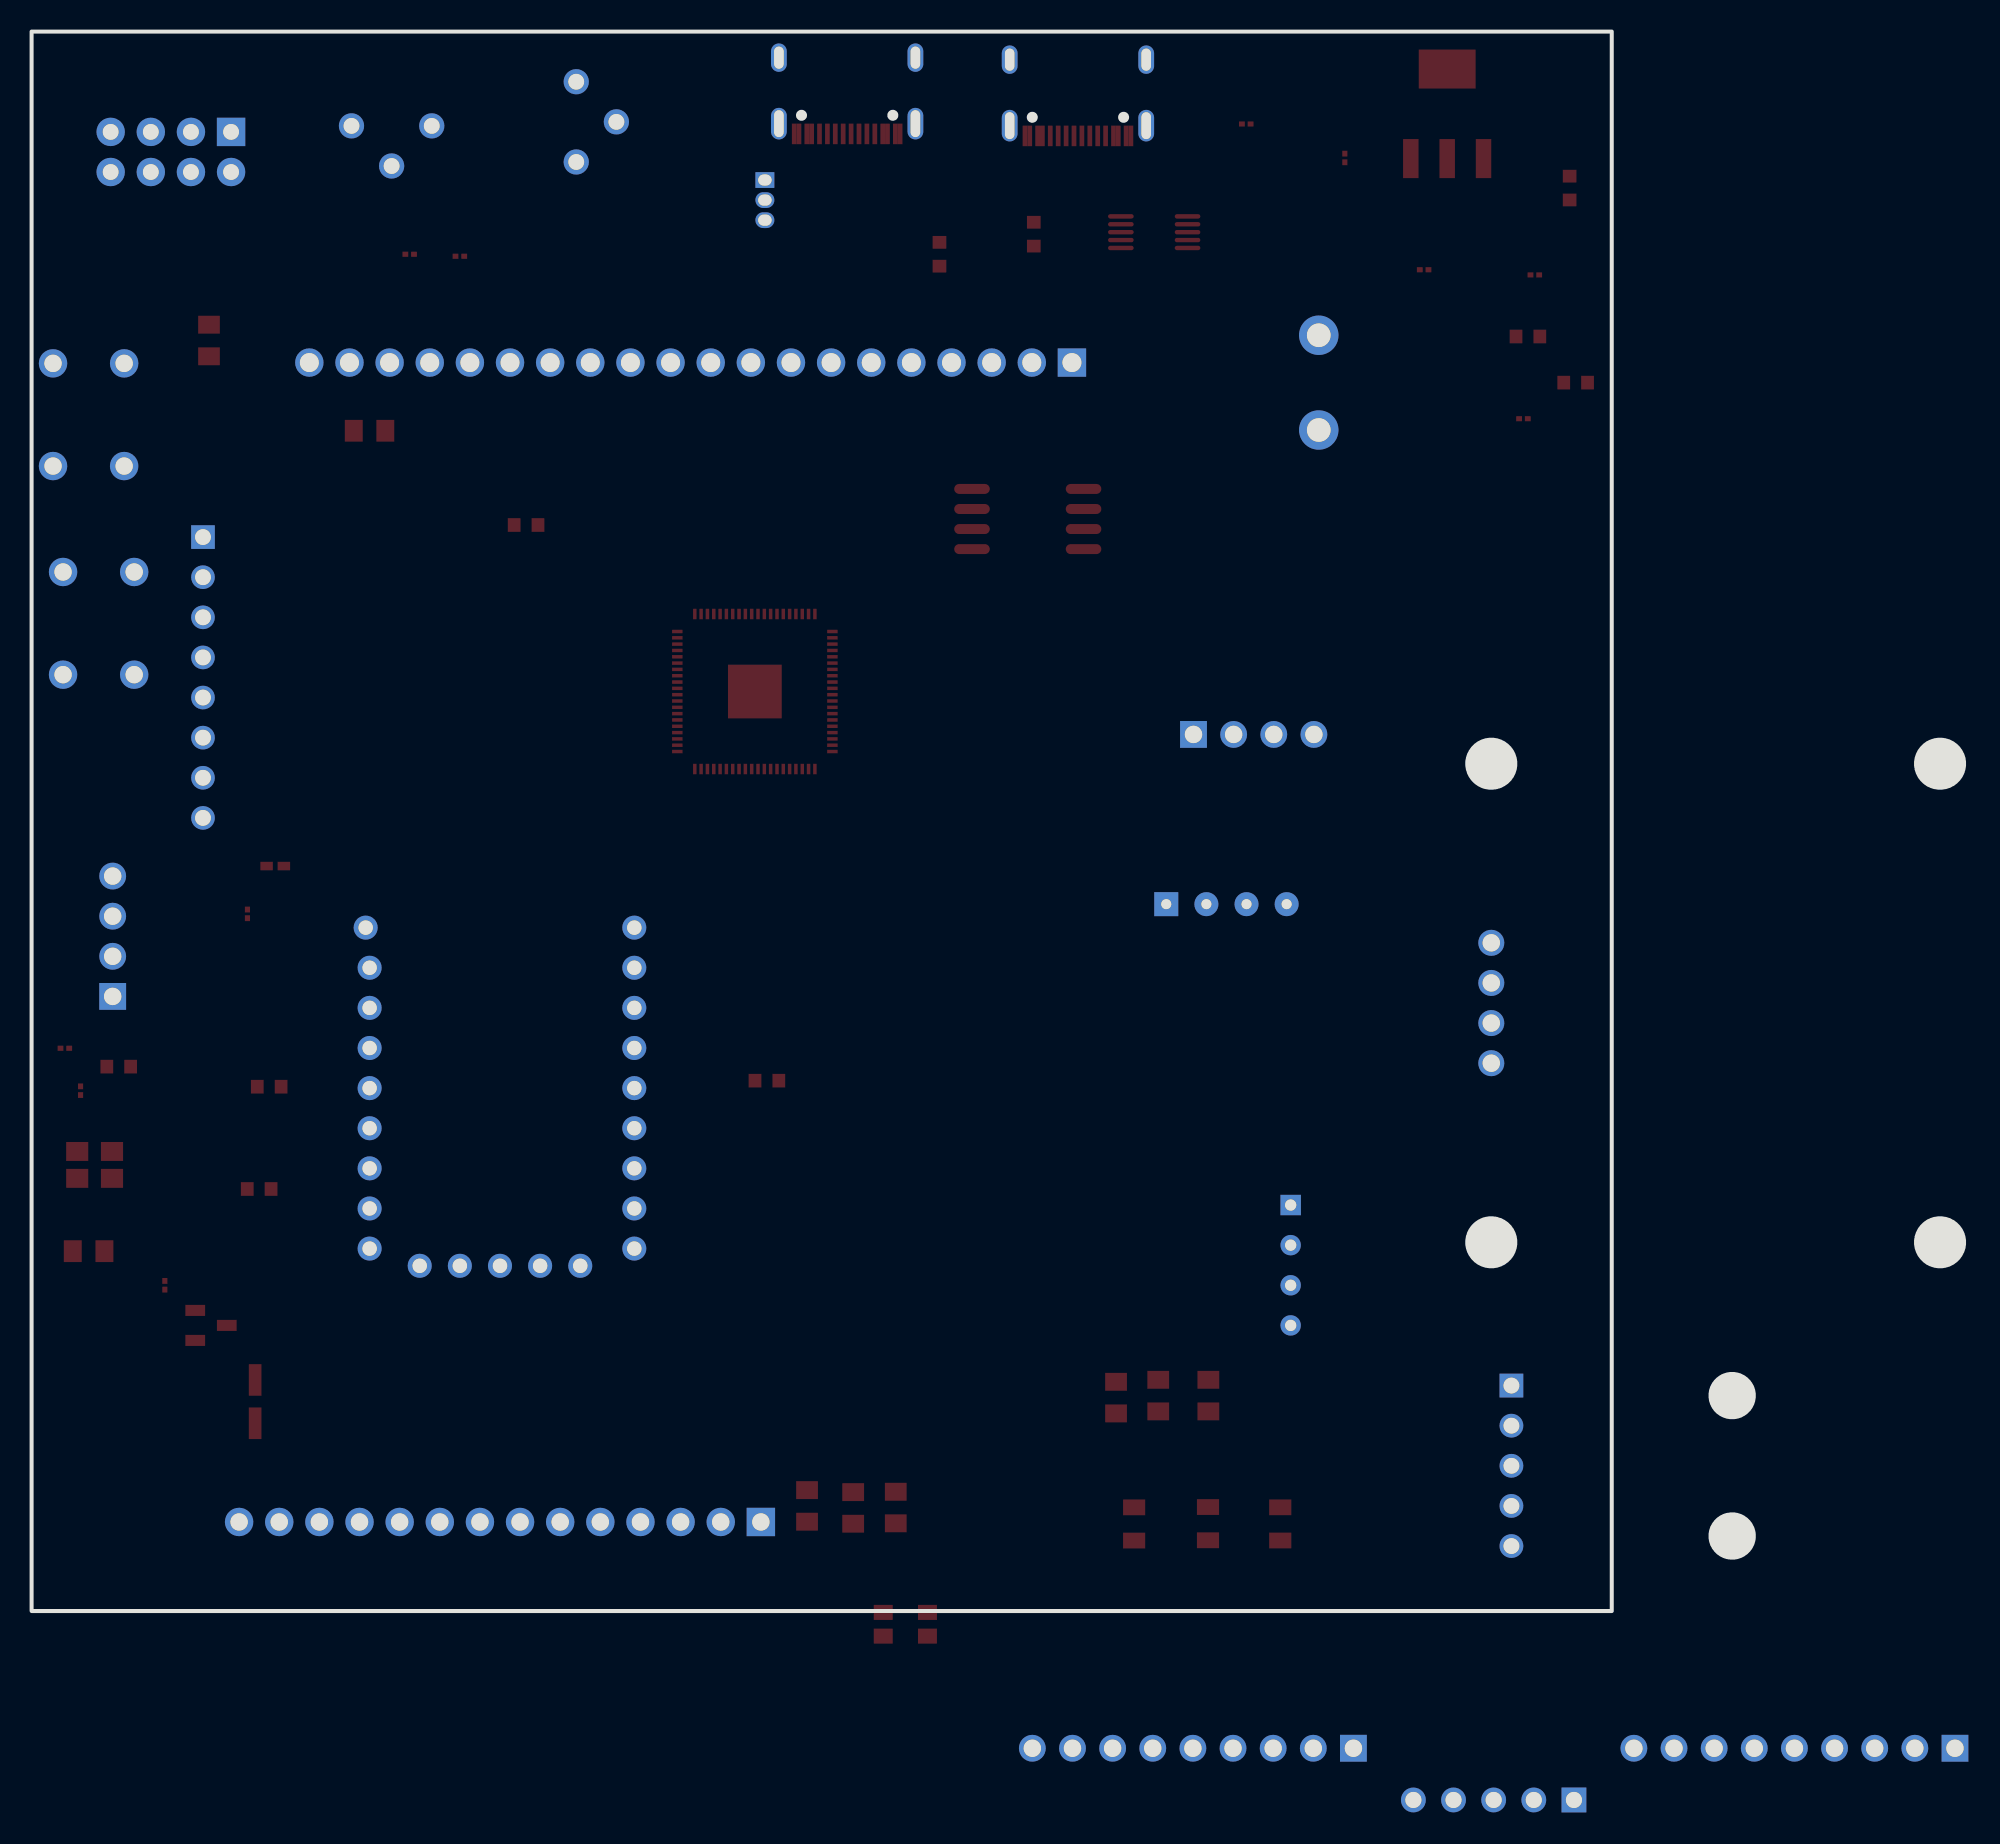
[diagram p2: board, bottom side, seen from below]

Outline 122.42 x 100 mm; copper layers: Top Layer, Bottom Layer. Coordinates in mm from the lower left corner of the outline.
Outline path: rectangle 22.42,100 122.42,0
Stack: Top Layer 0.035mm / Dielectric1 1.51mm FR4 er 4.5 / Bottom Layer 0.035mm

## Design rules (mm)
template: JLCPCB Capability(Two Layers Board)
spacing copperThickness1oz (default): track to track 0.102, other pairs 0.152 to 0.3
spacing copperThickness2oz: track to track 0.203, other pairs 0.152 to 0.3
track width copperThickness1oz (default): min 0.127, default 0.254, max 2.54
track width copperThickness2oz: min 0.203, default 0.254, max 2.54
differential pair differentialPair (default): width min 0.127, default 0.254, max 2.54; gap min 0.152, default 0.152
via viaSize (default): diameter min 0.5, default 0.61, max 10; hole min 0.3, default 0.305, max 6.3

## Placement (name value [footprint] x y rotation side)
1  -  [GY-302 (BH1750)]  21.15 9.19 180 top
BUZZER1  buzzer  [BUZ-TH_BD12.0-P6.00-D0.9-RD]  40.96 77.77 90 top
C1  100nF  [C0201]  95.32 85.78 0 top
C2  100nF  [C0201]  98.49 85.9 180 top
C3  15pF  [C0201]  120.32 35.63 0 top
C4  15pF  [C0201]  113.99 20.62 270 top
C5  4.7uF  [C0201]  34.3 84.92 180 top
C6  4.7uF  [C0201]  119.32 32.94 270 top
C7  4.7uF  [C0201]  108.76 44.14 90 top
C8  100nF  [CAP-SMD_BD3.0-L3.3-W3.3-RD]  108.27 13.26 270 top
C9  100nF  [C0201]  39.31 92 90 top
C10  100nF  [C0201]  27.29 84.59 180 top
C11  1nF  [C0201]  45.55 94.15 0 top
C12  1nF  [C0201]  28.01 75.49 0 top
DISP1  1.3寸OLED显示屏12864  [OLED-TH12864]  30.04 38.5 270 top
H1  CNY70  [HDR-TH_4P-P2.54-V-F]  117.29 42.72 90 top
H2  -  [HDR-TH_14P-P2.54-V-M]  92.78 5.64 0 top
H3  -  [HDR-TH_20P-P2.54-V-M-1]  80.71 79.04 0 top
H4  -  [HDR-TH_8P-P2.54-V-M]  111.58 59.11 270 top
H6  -  [HDR-TH_5P-P2.54-V-F]  29.89 -11.96 0 top
H7  -  [HDR-TH_9P-P2.54-V-F-1]  10.86 -8.69 0 top
H8  -  [HDR-TH_9P-P2.54-V-F-1]  48.93 -8.69 0 top
HTU21D  -  [HDR-TH_4P-P2.54-V-M]  45.08 55.5 180 top
L1  3.3uH  [L0402]  107 47.17 0 top
LED1  YLED0805W  [LED0805-R-RD_WHITE]  43.4 5.52 270 top
LED2  YLED0805W  [LED0805-R-RD_WHITE]  47.97 5.53 270 top
LED3  YLED0805W  [LED0805-R-RD_WHITE]  52.65 5.51 270 top
PR1  10K  [RES-ADJ-TH_3P-L9.5-W9.5-P2.54-BR-BS]  86.68 94.28 0 top
PR2  10K  [RES-ADJ-TH_3P-L9.5-W9.5-P2.54-BR-BS]  99.64 92.76 90 top
Q1  S8050  [SOT-23-3_L2.9-W1.3-P1.90-LS2.4-BR]  111.07 18.08 0 top
R1  33kΩ  [R0805]  47.95 13.64 90 top
R2  33kΩ  [R0805]  51.12 13.64 270 top
R3  33kΩ  [R0805]  53.79 13.51 270 top
R4  33kΩ  [R0805]  67.73 6.55 90 top
R5  33kΩ  [R0805]  70.43 6.53 90 top
R6  33kΩ  [R0805]  73.35 6.66 90 top
R7  33kΩ  [R0805]  118.81 22.78 180 top
R8  33kΩ  [R0805]  111.19 80.44 90 top
R9  33kΩ  [R0805]  101.03 74.73 0 top
R10  1K  [R0603]  108.02 26.72 180 top
R11  33  [R0603]  27.72 80.7 0 top
R12  10kΩ  [R0603]  75.89 33.58 0 top
R13  10kΩ  [R0603]  91.13 68.76 180 top
R14  DNF  [R0603]  107.38 33.2 180 top
R15  DNF  [R0603]  116.91 34.47 0 top
R16  5K1  [R0603]  24.71 77.77 0 top
R17  5K1  [R0603]  25.09 90.09 270 top
R18  5K1  [R0603]  59 87.17 90 top
R19  5K1  [R0603]  64.97 85.9 270 top
SW1  B3F-1000  [KEY-TH_4P-L6.2-W6.2-P4.50-LS6.5]  118.81 75.74 90 top
SW2  B3F-1000  [KEY-TH_4P-L6.2-W6.2-P4.50-LS6.5]  118.18 62.53 270 top
U1  RP2350B  [QFN-80_L10.0-W10.0-P0.40-TL-EP3.4]  76.65 58.22 0 top
U2  RP2040-Zero  [COMM-SMD_RP2040-ZERO]  92.78 32.56 0 top
U3  DS18B20  [TO-92-3_L4.5-W3.5-P1.27-L]  76.02 89.33 270 top
U4  DHT11  [SENSOR-TH_DHT11]  42.74 21.89 270 top
U5  2.4GHz  [WIFIM-TH_8P-L24.7-W14.4-P2.54]  113.61 92.38 90 top
U6  CLV1H-FKB-CMPRTHKBB2367453  [LED-SMD_4P-L3.2-W2.8-LS3.5-TL-B]  67.13 -0.84 0 top
U7  ABM8-272-T3  [CRYSTAL-SMD_4P-L3.2-W2.5-BL]  118.43 28.24 180 top
U8  BMP180  [BMP-180]  46.81 39.67 0 top
U9  W25Q128JVSIQ  [SOIC-8_L5.3-W5.3-P1.27-LS8.0-BL]  59.38 69.14 90 top
U10  -  [SOT-223-4_L6.5-W3.5-P2.30-LS7.0-BR]  32.84 94.79 270 top
U11  CH340E  [MSOP-10_L3.0-W3.0-P0.50-LS5.0-BL]  51.38 87.3 270 top
USB1  -  [USB-C-SMD_KH-TYPE-C-16P]  70.81 95.94 180 top
USB2  -  [USB-C-SMD_KH-TYPE-C-16P]  56.2 95.81 180 top

## Footprints (pads in the part's own frame, mm; a bottom-side part is the same pattern mirrored in y, then rotated)
BMP-180
  rect 1.524x1.524 hole 0.635: 1(3.81,5.08)
  round 1.524 hole 0.635: 2(1.27,5.08) 3(-1.27,5.08) 4(-3.81,5.08)
BUZ-TH_BD12.0-P6.00-D0.9-RD
  round 2.5 hole 1.5: 1(-3,0) 2(3,0)
C0201
  rect 0.368x0.324 smd: 1(-0.275,0) 2(0.275,0)
CAP-SMD_BD3.0-L3.3-W3.3-RD
  rect 2x0.8 smd: 1(1.37,0) 2(-1.37,0)
COMM-SMD_RP2040-ZERO
  round 1.524 hole 0.914: 24(-8.5,10.705) 25(-8.5,8.165) 26(-8.5,5.625) 27(-8.5,3.085) 28(-8.5,0.545) 29(-8.5,-1.995) 30(-8.5,-4.535) 31(-8.5,-7.075) 32(-8.5,-9.615) 33(-5.08,-10.705) 34(-2.54,-10.705) 35(0,-10.705) 36(2.54,-10.705) 37(5.08,-10.705) 38(8.25,-9.615) 39(8.25,-7.075) 40(8.25,-4.535) 41(8.25,-1.995) 42(8.25,0.545) 43(8.25,3.085) 44(8.25,5.625) 45(8.25,8.165) 46(8.5,10.705)
CRYSTAL-SMD_4P-L3.2-W2.5-BL
  rect 1.4x1.2 smd: 1(-1.1,-0.85) 2(1.1,-0.85) 3(1.1,0.85) 4(-1.1,0.85)
GY-302 (BH1750)
  rect 1.508x1.508 hole 1x1: 1(-7.62,-5.08)
  round 1.508 hole 1x1: 2(-7.62,-2.54) 3(-7.62,0) 4(-7.62,2.54) 5(-7.62,5.08)
HDR-TH_4P-P2.54-V-F
  rect 1.7x1.7 hole 1.1: 1(-3.81,0)
  round 1.7 hole 1.1: 2(-1.27,0) 3(1.27,0) 4(3.81,0)
HDR-TH_4P-P2.54-V-M
  rect 1.7x1.7 hole 1.1: 1(-3.81,0)
  round 1.7 hole 1.1: 2(-1.27,0) 3(1.27,0) 4(3.81,0)
HDR-TH_5P-P2.54-V-F
  rect 1.575x1.575 hole 1.02: 1(-5.08,0)
  round 1.575 hole 1.02: 2(-2.54,0) 3(0,0) 4(2.54,0) 5(5.08,0)
HDR-TH_8P-P2.54-V-M
  rect 1.5x1.5 hole 1: 1(-8.89,0)
  round 1.5 hole 1: 2(-6.35,0) 3(-3.81,0) 4(-1.27,0) 5(1.27,0) 6(3.81,0) 7(6.35,0) 8(8.89,0)
HDR-TH_9P-P2.54-V-F-1
  rect 1.7x1.7 hole 1.1: 1(-10.16,0)
  round 1.7 hole 1.1: 2(-7.62,0) 3(-5.08,0) 4(-2.54,0) 5(0,0) 6(2.54,0) 7(5.08,0) 8(7.62,0) 9(10.16,0)
HDR-TH_14P-P2.54-V-M
  rect 1.8x1.8 hole 1.1: 1(-16.51,0)
  round 1.8 hole 1.1: 2(-13.97,0) 3(-11.43,0) 4(-8.89,0) 5(-6.35,0) 6(-3.81,0) 7(-1.27,0) 8(1.27,0) 9(3.81,0) 10(6.35,0) 11(8.89,0) 12(11.43,0) 13(13.97,0) 14(16.51,0)
HDR-TH_20P-P2.54-V-M-1
  rect 1.8x1.8 hole 1.2: 1(-24.13,0)
  round 1.8 hole 1.2: 2(-21.59,0) 3(-19.05,0) 4(-16.51,0) 5(-13.97,0) 6(-11.43,0) 7(-8.89,0) 8(-6.35,0) 9(-3.81,0) 10(-1.27,0) 11(1.27,0) 12(3.81,0) 13(6.35,0) 14(8.89,0) 15(11.43,0) 16(13.97,0) 17(16.51,0) 18(19.05,0) 19(21.59,0) 20(24.13,0)
KEY-TH_4P-L6.2-W6.2-P4.50-LS6.5
  round 1.8 hole 1.1: 1(-3.251,2.251) 2(3.251,2.251) 3(-3.251,-2.251) 4(3.251,-2.251)
L0402
  rect 0.79x0.54 smd: 1(-0.545,0) 2(0.545,0)
LED0805-R-RD_WHITE
  rect 1x1.399 smd: 1(1.05,0) 2(-1.05,0)
LED-SMD_4P-L3.2-W2.8-LS3.5-TL-B
  rect 1.2x0.95 smd: 1(-1.4,0.75) 2(-1.4,-0.75) 3(1.4,-0.75) 4(1.4,0.75)
MSOP-10_L3.0-W3.0-P0.50-LS5.0-BL
  oval 0.28x1.62 smd: 1(-1,-2.11) 2(-0.5,-2.11) 3(0,-2.11) 4(0.5,-2.11) 5(1,-2.11) 6(1,2.11) 7(0.5,2.11) 8(0,2.11) 9(-0.5,2.11) 10(-1,2.11)
OLED-TH12864
  round 1.65 hole 1.1: 1(-3.81,0) 2(-1.27,0) 3(1.27,0) 4(3.81,0)
QFN-80_L10.0-W10.0-P0.40-TL-EP3.4
  rect 0.665x0.22 smd: 1(-4.907,3.8) 2(-4.907,3.4) 3(-4.907,3) 4(-4.907,2.6) 5(-4.907,2.2) 6(-4.907,1.8) 7(-4.907,1.4) 8(-4.907,1) 9(-4.907,0.6) 10(-4.907,0.2) 11(-4.907,-0.2) 12(-4.907,-0.6) 13(-4.907,-1) 14(-4.907,-1.4) 15(-4.907,-1.8) 16(-4.907,-2.2) 17(-4.907,-2.6) 18(-4.907,-3) 19(-4.907,-3.4) 20(-4.907,-3.8) 41(4.907,-3.8) 42(4.907,-3.4) 43(4.907,-3) 44(4.907,-2.6) 45(4.907,-2.2) 46(4.907,-1.8) 47(4.907,-1.4) 48(4.907,-1) 49(4.907,-0.6) 50(4.907,-0.2) 51(4.907,0.2) 52(4.907,0.6) 53(4.907,1) 54(4.907,1.4) 55(4.907,1.8) 56(4.907,2.2) 57(4.907,2.6) 58(4.907,3) 59(4.907,3.4) 60(4.907,3.8)
  rect 0.22x0.665 smd: 21(-3.8,-4.907) 22(-3.4,-4.907) 23(-3,-4.907) 24(-2.6,-4.907) 25(-2.2,-4.907) 26(-1.8,-4.907) 27(-1.4,-4.907) 28(-1,-4.907) 29(-0.6,-4.907) 30(-0.2,-4.907) 31(0.2,-4.907) 32(0.6,-4.907) 33(1,-4.907) 34(1.4,-4.907) 35(1.8,-4.907) 36(2.2,-4.907) 37(2.6,-4.907) 38(3,-4.907) 39(3.4,-4.907) 40(3.8,-4.907) 61(3.8,4.907) 62(3.4,4.907) 63(3,4.907) 64(2.6,4.907) 65(2.2,4.907) 66(1.8,4.907) 67(1.4,4.907) 68(1,4.907) 69(0.6,4.907) 70(0.2,4.907) 71(-0.2,4.907) 72(-0.6,4.907) 73(-1,4.907) 74(-1.4,4.907) 75(-1.8,4.907) 76(-2.2,4.907) 77(-2.6,4.907) 78(-3,4.907) 79(-3.4,4.907) 80(-3.8,4.907)
  rect 3.4x3.4 smd: 81(0,0)
R0603
  rect 0.806x0.864 smd: 1(-0.753,0) 2(0.753,0)
R0805
  rect 1.133x1.377 smd: 1(-1,0) 2(1,0)
RES-ADJ-TH_3P-L9.5-W9.5-P2.54-BR-BS
  round 1.6 hole 1: 1(1.27,-2.54) 2(-1.27,0) 3(1.27,2.54)
SENSOR-TH_DHT11
  rect 1.296x1.296 hole 0.711: 1(-3.81,0)
  round 1.296 hole 0.711: 2(-1.27,0) 3(1.27,0) 4(3.81,0)
SOIC-8_L5.3-W5.3-P1.27-LS8.0-BL
  oval 0.63x2.25 smd: 1(-1.905,-3.53) 2(-0.635,-3.53) 3(0.635,-3.53) 4(1.905,-3.53) 5(1.905,3.53) 6(0.635,3.53) 7(-0.635,3.53) 8(-1.905,3.53)
SOT-23-3_L2.9-W1.3-P1.90-LS2.4-BR
  rect 1.25x0.7 smd: 1(1,-0.95) 2(1,0.95) 3(-1,0)
SOT-223-4_L6.5-W3.5-P2.30-LS7.0-BR
  rect 2.47x0.98 smd: 1(2.835,-2.3) 2(2.835,0) 3(2.835,2.3)
  rect 2.47x3.6 smd: 4(-2.835,0)
TO-92-3_L4.5-W3.5-P1.27-L
  rect 1x1.2 hole 0.7x0.85: 1(-1.27,0)
  oval 1x1.2 hole 0.7x0.85: 2(0,0) 3(1.27,0)
USB-C-SMD_KH-TYPE-C-16P
  oval 1x2 hole 0.6x1.7: 1(-4.32,1.765) 2(4.32,1.765)
  oval 1x1.8 hole 0.6x1.4: 3(-4.32,-2.415) 4(4.32,-2.415)
  rect 0.3x1.3 smd: A1(-3.35,2.415) A4(-2.55,2.415) A5(-1.25,2.415) A6(-0.25,2.415) A7(0.25,2.415) A8(1.25,2.415) A9(2.55,2.415) A12(3.35,2.415) B1(3.05,2.415) B4(2.25,2.415) B5(1.75,2.415) B6(0.75,2.415) B7(-0.75,2.415) B8(-1.75,2.415) B9(-2.25,2.415) B12(-3.05,2.415)
WIFIM-TH_8P-L24.7-W14.4-P2.54
  rect 1.8x1.8 hole 1: 1(1.27,3.81)
  round 1.8 hole 1: 2(1.27,1.27) 3(1.27,-1.27) 4(1.27,-3.81) 5(-1.27,3.81) 6(-1.27,1.27) 7(-1.27,-1.27) 8(-1.27,-3.81)

## Nets
1V1: C7.2 L1.1
3V3: 1.1 BUZZER1.2 C6.1 C8.1 C10.2 DISP1.1 H1.1 HTU21D.4 LED1.1 LED2.1 LED3.1 PR1.1 PR2.1 Q1.3 R8.1 R9.1 R11.1 R14.1 R15.2 U1.64 U3.3 U4.1 U5.8 U6.1 U8.1 U9.8 U10.2 U11.10
GND: 1.2 BUZZER1.1 C1.2 C2.2 C3.1 C4.2 C5.2 C6.2 C7.1 C8.2 C9.1 C10.1 C11.2 C12.2 DISP1.4 H1.2 H7.2 HTU21D.3 PR1.3 PR2.3 Q1.2 R16.1 R17.1 R18.1 R19.1 SW1.3 SW2.3 U1.62 U1.81 U3.1 U4.4 U5.1 U7.2 U9.4 U10.1 U11.3 USB1.A1 USB1.A12 USB1.B1 USB1.B12 USB2.A1 USB2.A12 USB2.B1 USB2.B12
GPIO2_U1: U1.79 U3.2
GPIO3_U1: U1.80 U4.2
I2C_SCL_0: H8.6 U1.2
I2C_SCL_1: 1.3 DISP1.2 HTU21D.1 U1.4 U8.3
I2C_SDA_0: H8.5 U1.1
I2C_SDA_1: 1.4 DISP1.3 HTU21D.2 U1.3 U8.4
NET1: USB1.A9
QSPI_SCLK: U1.71 U9.6
QSPI_SD0: U1.72 U9.5
QSPI_SD1: U1.74 U9.2
QSPI_SD2: U1.73 U9.3
QSPI_SD3: U1.70 U9.7
REG_3V3_1: C9.2 U10.3 USB1.A4 USB1.B4 USB1.B9
RP2040_ADC0: C1.1 H2.11 H7.7 PR1.2
RP2040_ADC1: C2.1 H2.12 H7.6 PR2.2
RP2040_ADC2: H2.13 H7.5
RP2040_ADC3: H2.14 H7.4
RP2040_GP6: H2.1 H8.7
RP2040_GP7: H2.2 H8.8
RP2040_GP8: H2.3 H8.9
RP2040_GP9: H2.4 H6.1
RP2040_GP10: H2.5 H6.2
RP2040_GP11: H2.6 H6.3
RP2040_GP12: H2.7 H6.4
RP2040_GP13: H2.8 H6.5
RP2040_GP14: H2.10 H7.9
RP2040_GP15: H2.9 H7.8
RP2350_ADC0: H4.8 U1.49
RP2350_ADC1: H4.7 U1.52
RP2350_ADC2: H4.6 U1.53
RP2350_ADC3: H4.5 U1.54
RP2350_ADC4: H4.4 U1.55
RP2350_ADC5: H4.3 U1.56
RP2350_ADC6: H4.2 U1.57
RP2350_ADC7: H4.1 U1.58
RP2350_GP10: R1.1 U1.8
RP2350_GP11: R2.1 U1.9
RP2350_GP12: R3.1 U1.11
RP2350_GP13: R4.1 U1.12
RP2350_GP14: R5.1 U1.13
RP2350_GP15: R6.1 U1.14
RP2350_GP16: R7.1 SW1.1 U1.16
RP2350_GP17: SW2.1 U1.17
RP2350_GP18: U1.18
RP2350_GP19: H1.3 U1.19
RP2350_GP20: H3.1 U1.20
RP2350_GP21: H3.2 U1.21
RP2350_GP22: H3.3 U1.22
RP2350_GP23: H3.4 U1.23
RP2350_GP24: H3.5 U1.25
RP2350_GP25: H3.6 U1.26
RP2350_GP26: H3.7 U1.27
RP2350_GP27: H3.8 U1.28
RP2350_GP28: H3.9 U1.36
RP2350_GP29: H3.10 U1.37
RP2350_GP30: H3.11 U1.38
RP2350_GP31: H3.12 U1.39
RP2350_GP32: H3.13 U1.40
RP2350_GP33: H3.14 U1.42
RP2350_GP34: H3.15 U1.43
RP2350_GP35: H3.16 U1.44
RP2350_GP36: H3.17 U1.45
RP2350_GP37: H3.18 U1.46
RP2350_GP38: H3.19 U1.47
RP2350_GP39: H3.20 U1.48
RP2350_GPIO0: R15.1
RP2350_RX: H8.1 U1.78
RP2350_RX_1: U1.7 U5.5 U11.8
RP2350_TX: H8.2 U1.77
RP2350_TX_1: U1.6 U5.4 U11.9
RP2350_VREG_AVDD: C5.1 R11.2 U1.61
RP2350_VREG_LX: L1.2 U1.63
RP2350_XIN: C3.2 U1.30 U7.1
RP2350_XOUT: R10.1 U1.31
SWCLK: H8.3 U1.33
SWDIO: H8.4 U1.34
USB_D+: R13.2 USB1.A6 USB1.B6
USB_D-: R12.2 USB1.A7 USB1.B7
USB_UART_D+: U11.1 USB2.A6 USB2.B6
USB_UART_D-: U11.2 USB2.A7 USB2.B7
$1N3968: LED1.2 R1.2
$1N3972: LED2.2 R2.2
$1N3977: LED3.2 R3.2
$1N4027: R6.2 U6.4
$1N4032: R5.2 U6.3
$1N4037: R4.2 U6.2
$1N4236: Q1.1 R7.2
$1N4467: R8.2 SW1.2
$1N4681: R9.2 SW2.2
$1N8203: C4.1 R10.2 U7.3
$1N8265: U7.4
$1N8424: U8.2
$1N10864: R12.1 U1.66
$1N10892: R13.1 U1.67
$1N11685: R14.2 U9.1
$1N15103: R16.2 USB1.A5
$1N15154: R17.2 USB1.B5
$1N16224: R19.2 USB2.B5
$1N16240: R18.2 USB2.A5
$1N16303: C11.1 USB2.1 USB2.2 USB2.3 USB2.4
$1N16516: C12.1 USB1.1 USB1.2 USB1.3 USB1.4

Pads without a net: 1 5; H1 4; H7 1 3; SW1 4; SW2 4; U1 5 10 15 24 29 32 35 41 50 51 59 60 65 68 69 75 76; U2 24 25 26 27 28 29 30 31 32 33 34 35 36 37 38 39 40 41 42 43 44 45 46; U4 3; U5 2 3 6 7; U10 4; U11 4 5 6 7; USB1 A8 B8; USB2 A4 A8 A9 B4 B8 B9
